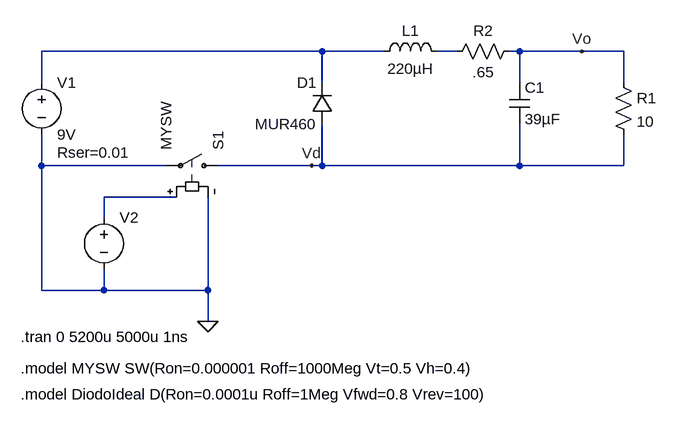
[diagram p0: schematic Punto 2 (Fuente Buck).asc]
Punto 2 (Fuente Buck).asc, the LTspice schematic file:
Version 4
SHEET 1 944 680
WIRE 416 96 -16 96
WIRE 512 96 416 96
WIRE 624 96 592 96
WIRE 720 96 704 96
WIRE 816 96 720 96
WIRE 880 96 816 96
WIRE -16 144 -16 96
WIRE 416 144 416 96
WIRE 720 144 720 96
WIRE 880 144 880 96
WIRE -16 272 -16 224
WIRE 176 272 -16 272
WIRE 400 272 256 272
WIRE 416 272 416 208
WIRE 416 272 400 272
WIRE 720 272 720 208
WIRE 720 272 416 272
WIRE 880 272 880 224
WIRE 880 272 720 272
WIRE 192 320 80 320
WIRE 80 352 80 320
WIRE -16 464 -16 272
WIRE 80 464 80 432
WIRE 80 464 -16 464
WIRE 240 464 240 320
WIRE 240 464 80 464
WIRE 240 512 240 464
FLAG 240 512 0
FLAG 816 96 Vo
FLAG 400 272 Vd
SYMBOL voltage -16 128 R0
WINDOW 123 0 0 Left 0
WINDOW 39 24 124 Left 2
SYMATTR SpiceLine Rser=0.01
SYMATTR InstName V1
SYMATTR Value 9V
SYMBOL res 864 128 R0
SYMATTR InstName R1
SYMATTR Value 10
SYMBOL ind 496 112 R270
WINDOW 0 32 56 VTop 2
WINDOW 3 5 56 VBottom 2
SYMATTR InstName L1
SYMATTR Value 220µH
SYMATTR SpiceLine Rser=.00000000001
SYMBOL cap 704 144 R0
SYMATTR InstName C1
SYMATTR Value 39µF
SYMATTR SpiceLine Rser=0.23
SYMBOL sw 272 272 M270
SYMATTR InstName S1
SYMATTR Value MYSW
SYMBOL voltage 80 336 R0
WINDOW 3 24 96 Invisible 2
WINDOW 123 0 0 Left 0
WINDOW 39 0 0 Left 0
SYMATTR Value PULSE(0 1 0 1n 1n 9.674u 20u)
SYMATTR InstName V2
SYMBOL diode 432 208 R180
WINDOW 0 24 64 Left 2
WINDOW 3 24 0 Left 2
SYMATTR InstName D1
SYMATTR Value MUR460
SYMBOL res 720 80 R90
WINDOW 0 0 56 VBottom 2
WINDOW 3 32 56 VTop 2
SYMATTR InstName R2
SYMATTR Value .65
TEXT -48 536 Left 2 !.tran 0 5200u 5000u 1ns
TEXT -48 584 Left 2 !.model MYSW SW(Ron=0.000001 Roff=1000Meg Vt=0.5 Vh=0.4)
TEXT -48 624 Left 2 !.model DiodoIdeal D(Ron=0.0001u Roff=1Meg Vfwd=0.8 Vrev=100)

The netlist it stands for:
* Punto 2 (Fuente Buck).asc
V1 N001 0 9V Rser=0.01
R1 Vo Vd 10
L1 N001 N002 220µH Rser=.00000000001
C1 Vo Vd 39µF Rser=0.23
S1 Vd 0 N003 0 MYSW
V2 N003 0 PULSE(0 1 0 1n 1n 9.674u 20u)
D1 Vd N001 MUR460
R2 Vo N002 .65
.model D D
.lib standard.dio
.tran 0 5200u 5000u 1ns
.model MYSW SW(Ron=0.000001 Roff=1000Meg Vt=0.5 Vh=0.4)
.model DiodoIdeal D(Ron=0.0001u Roff=1Meg Vfwd=0.8 Vrev=100)
.backanno
.end